# Altium schematic sheet Core.SchDoc
size A4
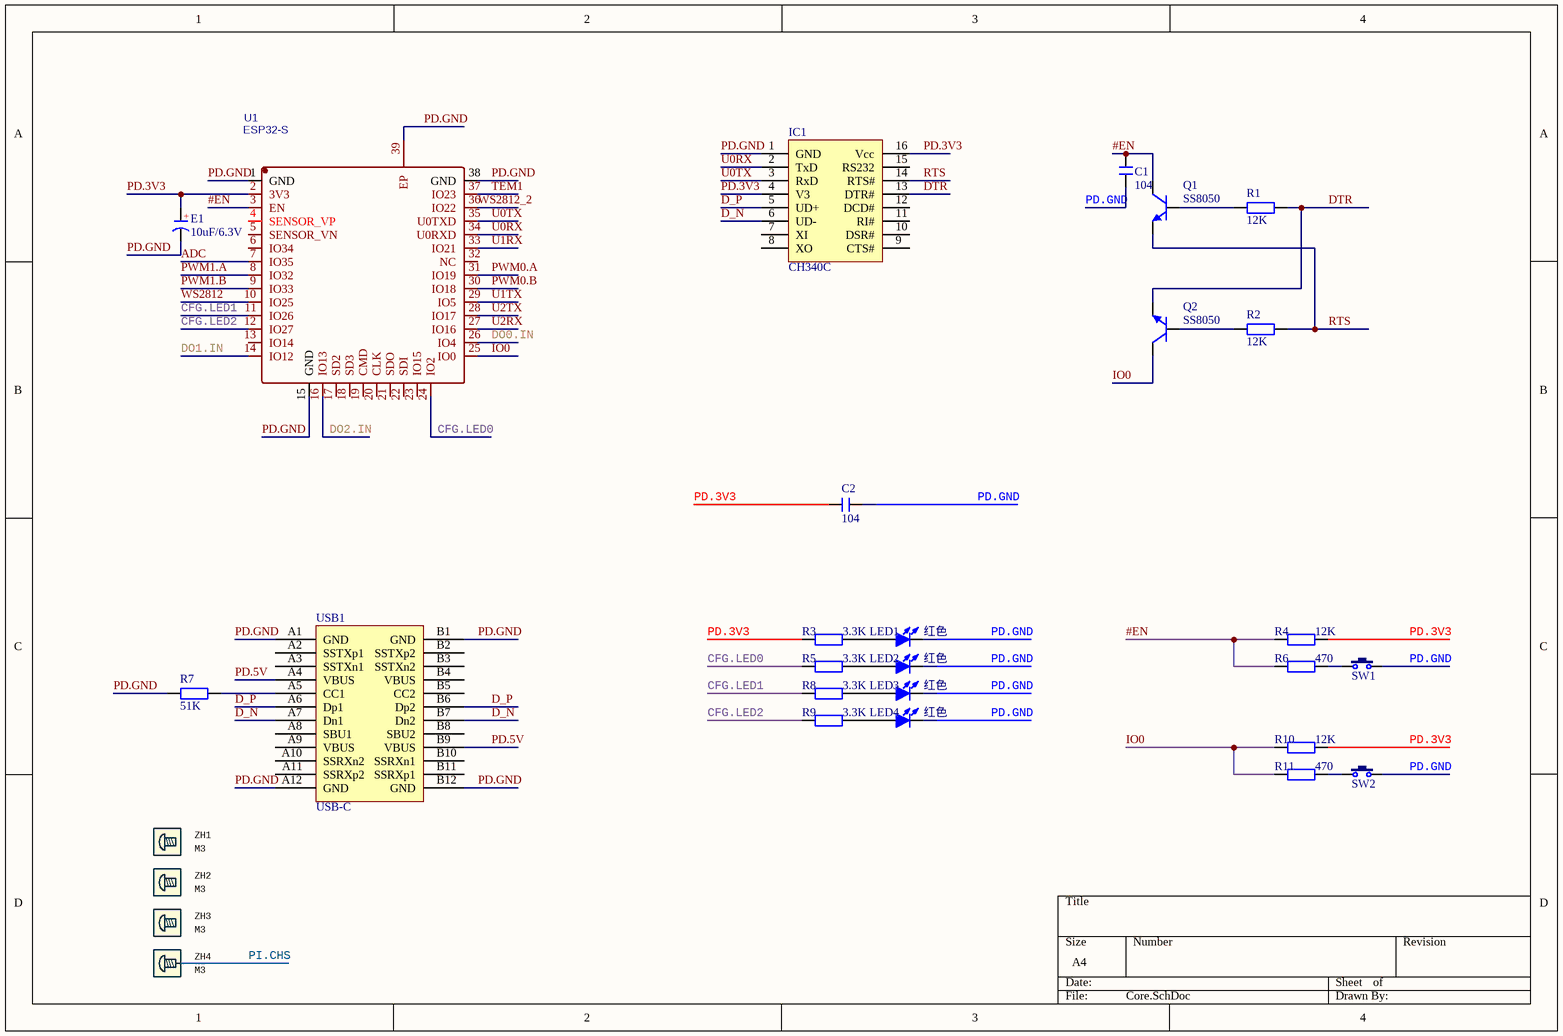
[diagram p0: Core.SchDoc]

## Parts
C1  104  [C 0603_L]
C2  104  [C 0603]
E1  10uF/6.3V  [CD A(3216)]
IC1  CH340C  [SOP16_L]
LED1  红色  [LED 0603R]
LED2  红色  [LED 0603R]
LED3  红色  [LED 0603R]
LED4  红色  [LED 0603R]
Q1  SS8050  [SOT23-3N]
Q2  SS8050  [SOT23-3N]
R1  12K  [R 0603]
R2  12K  [R 0603]
R3  3.3K  [R 0603]
R4  12K  [R 0603]
R5  3.3K  [R 0603]
R6  470  [R 0603]
R7  51K  [R 0603]
R8  3.3K  [R 0603]
R9  3.3K  [R 0603]
R10  12K  [R 0603]
R11  470  [R 0603]
SW1  3x6x5  [TSW SMD-3*6*2.5]  (value not drawn)
SW2  3x6x5  [TSW SMD-3*6*2.5]  (value not drawn)
U1  ESP32-S  [ESP32-S]
USB1  USB-C  [TYPE-C-31-M-12]
ZH1  M3  [ZH_Mount_NPH_M3.0]  (no BOM)
ZH2  M3  [ZH_Mount_NPH_M3.0]  (no BOM)
ZH3  M3  [ZH_Mount_NPH_M3.0]  (no BOM)
ZH4  M3  [ZH_Mount_PH_M3.0]  (no BOM)

## Nets
#EN: C1.2 Q1.3(C) R4.2 R6.2 U1.3(EN)
ADC: U1.7(IO35)
CFG.LED0: R5.2 U1.24(IO2)
CFG.LED1: R8.2 U1.11(IO26)
CFG.LED2: R9.2 U1.12(IO27)
D_N: IC1.6(UD-) USB1.A7(Dn1) USB1.B7(Dn2)
D_P: IC1.5(UD+) USB1.A6(Dp1) USB1.B6(Dp2)
DO0.IN: U1.26(IO4)
DO1.IN: U1.14(IO12)
DO2.IN: U1.16(IO13)
DTR: IC1.13(DTR#) Q2.2(E) R1.2
IO0: Q2.3(C) R10.2 R11.2 U1.25(IO0)
PD.3V3: C2.2 E1.1(A) IC1.4(V3) IC1.16(Vcc) R3.2 R4.1 R10.1 U1.2(3V3)
PD.5V: USB1.A4(VBUS) USB1.B9(VBUS)
PD.GND: C1.1 C2.1 E1.2(K) IC1.1(GND) LED1.2(K) LED2.2(K) LED3.2(K) LED4.2(K) R7.2 SW1.2 SW2.2 U1.1(GND) U1.15(GND) U1.38(GND) U1.39(EP) USB1.A1(GND) USB1.A12(GND) USB1.B1(GND) USB1.B12(GND)
PI.CHS: ZH4.H
PWM0.A: U1.31(IO19)
PWM0.B: U1.30(IO18)
PWM1.A: U1.8(IO32)
PWM1.B: U1.9(IO33)
RTS: IC1.14(RTS#) Q1.2(E) R2.2
TEM1: U1.37(IO23)
U0RX: IC1.2(TxD) U1.34(U0RXD)
U0TX: IC1.3(RxD) U1.35(U0TXD)
U1RX: U1.33(IO21)
U1TX: U1.29(IO5)
U2RX: U1.27(IO16)
U2TX: U1.28(IO17)
WS2812: U1.10(IO25)
WS2812_2: U1.36(IO22)
NetLED1_1: LED1.1(A) R3.1
NetLED2_1: LED2.1(A) R5.1
NetLED3_1: LED3.1(A) R8.1
NetLED4_1: LED4.1(A) R9.1
NetQ1_1: Q1.1(B) R1.1
NetQ2_1: Q2.1(B) R2.1
NetR6_1: R6.1 SW1.1
NetR7_1: R7.1 USB1.A5(CC1)
NetR11_1: R11.1 SW2.1

Not connected (* = marked no-connect by the designer): IC1 7(XI) 8(XO) 9(CTS#) 10(DSR#) 11(RI#) 12(DCD#) 15(RS232); U1 4(SENSOR_VP) 5(SENSOR_VN) 6(IO34) 13(IO14) 17(SD2) 18(SD3) 19(CMD) 20(CLK) 21(SDO) 22(SDI) 23(IO15) 32(NC); USB1 A2(SSTXp1) A3(SSTXn1) A8(SBU1) A9(VBUS) A10(SSRXn2) A11(SSRXp2) B2(SSTXp2) B3(SSTXn2) B4(VBUS) B5(CC2) B8(SBU2) B10(SSRXn1) B11(SSRXp1)

## Notes on the sheet
- (in symbol C-CD) +

## Library data of the parts
C1 = C: 无极性贴片电容; 版权归属: 源创客; 材质: X7R; BOM名称: 无极性贴片电容; 学习资源: www.ooocke.com
C2 = C: 无极性贴片电容; 版权归属: 源创客; BOM名称: 无极性贴片电容; 学习资源: www.ooocke.com
E1 = C-CD: 贴片钽电容; 版权归属: 源创客; BOM名称: 贴片钽电容; 学习资源: www.ooocke.com
IC1 = CH340G: 串口转USB; 版权归属: 源创客; BOM名称: 串口转USB; 学习资源: www.ooocke.com
LED1-LED4 = LED-SMD: 贴片LED; 版权归属: 源创客; BOM名称: 贴片LED; 学习资源: www.ooocke.com
Q1 Q2 = 8050-SMD: 高频放大-NPN型; 版权归属: 源创客; 属性: 40V 1.5A 1W 100MHZ; BOM名称: 高频放大-NPN型; 学习资源: www.ooocke.com
R1-R11 = R: 贴片电阻; 版权归属: 源创客; BOM名称: 贴片电阻; 学习资源: www.ooocke.com
SW1 SW2 = TSW 3x6: 3x6轻触开关; 版权归属: 源创客; BOM名称: 3x6轻触开关; 学习资源: www.ooocke.com
U1 = ESP32-S: BOM_Manufacturer: Ai-Thinker; Contributor: LCSC; BOM_Paste Type: expand; BOM_Supplier: LCSC; BOM_Supplier Part: C277944; BOM_Manufacturer Part: ESP32-S; spicePre: U; spiceSymbolName: ESP32-S
USB1 = USB-C/S: USB-C型母接口; 版权归属: 源创客; BOM名称: USB-C型母接口; 学习资源: www.ooocke.com
ZH1-ZH3 = Misc_Mount: ZH
ZH4 = Misc_Mount_Plated: ZH; ARG-CON-Dir: YES